# Altium project FPGA Board.PrjPcb
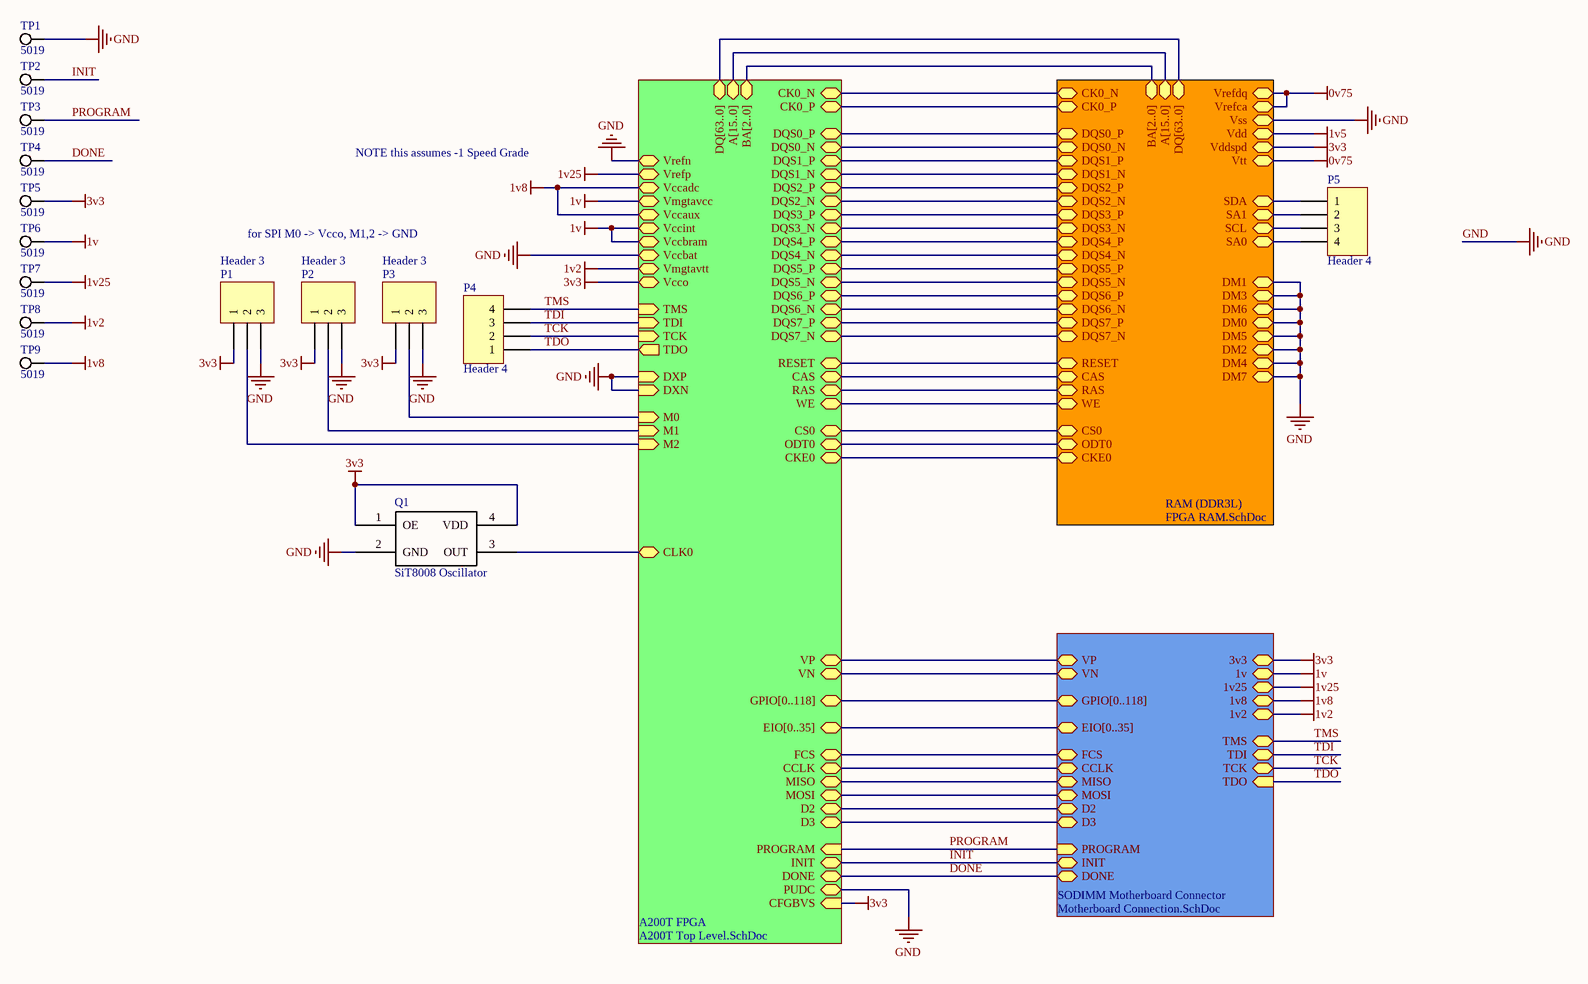
[diagram p0: FPGA Board Top.SchDoc]
3 sheets, 58 parts. Net scope: hierarchical (ports join the sheet entries above them; power ports are global).
Board file: FPGA Board V1.PcbDoc
Sheets:
  FPGA Board Top.SchDoc
    A200T FPGA = A200T Top Level.SchDoc
    RAM (DDR3L) = FPGA RAM.SchDoc

## Sheet FPGA Board Top.SchDoc
size C; SheetNumber: 1; SheetTotal: 4

### Parts
P1  Header 3  [HDR1X3]
P2  Header 3  [HDR1X3]
P3  Header 3  [HDR1X3]
P4  Header 4  [HDR1X4]
P5  Header 4  [HDR1X4]
Q1  SiT8008 Oscillator  [SiT8008 2.5x2]
TP1  5019  [KSTN-5019_V]
TP2  5019  [KSTN-5019_V]
TP3  5019  [KSTN-5019_V]
TP4  5019  [KSTN-5019_V]
TP5  5019  [KSTN-5019_V]
TP6  5019  [KSTN-5019_V]
TP7  5019  [KSTN-5019_V]
TP8  5019  [KSTN-5019_V]
TP9  5019  [KSTN-5019_V]

### Sub-sheets
A200T FPGA = A200T Top Level.SchDoc: BA[2..0] (bidir), A[15..0] (bidir), DQS1_P (bidir), DQS2_N (bidir), DQS7_N (bidir), DQS0_P (bidir), DQS6_N (bidir), DQS6_P (bidir), DQS1_N (bidir), DQS7_P (bidir), DQS4_P (bidir), DQS5_N (bidir), DQS3_P (bidir), DQS0_N (bidir), DQS2_P (bidir), DQS3_N (bidir), DQS4_N (bidir), DQS5_P (bidir), RAS (bidir), RESET (bidir), WE (bidir), CAS (bidir), CK0_P (bidir), CK0_N (bidir), ODT0 (bidir), CS0 (bidir), CKE0 (bidir), Vrefp (bidir), Vccadc (bidir), Vmgtavcc (bidir), Vccaux (bidir), Vccint (bidir), Vccbram (bidir), Vccbat (bidir), Vmgtavtt (bidir), Vcco (bidir), DQ[63..0] (bidir), Vrefn (bidir), PUDC (bidir), FCS (bidir), CCLK (bidir), INIT (bidir), MISO (bidir), DONE (bidir), MOSI (bidir), D2 (bidir), D3 (bidir), CLK0 (bidir), VP (bidir), VN (bidir), EIO[0..35] (bidir), GPIO[0..118] (bidir), TDO (out), CFGBVS (in), TMS (in), TCK (in), PROGRAM (in), TDI (in), DXP (in), M2 (in), M0 (in), DXN (in), M1 (in)
RAM (DDR3L) = FPGA RAM.SchDoc: Vrefdq (bidir), Vrefca (bidir), Vss (bidir), Vdd (bidir), DQS0_P (bidir), DQS6_N (bidir), DQS7_P (bidir), DQS1_P (bidir), DQS7_N (bidir), DQS3_P (bidir), DQS1_N (bidir), DQS4_N (bidir), DQS2_P (bidir), DQS5_P (bidir), DQS3_N (bidir), DQS4_P (bidir), DQS5_N (bidir), DQS2_N (bidir), DQS0_N (bidir), DQS6_P (bidir), SDA (bidir), SA1 (bidir), SCL (bidir), SA0 (bidir), Vddspd (bidir), Vtt (bidir), BA[2..0] (bidir), A[15..0] (bidir), CK0_N (bidir), CK0_P (bidir), RESET (bidir), CAS (bidir), RAS (bidir), WE (bidir), CS0 (bidir), ODT0 (bidir), CKE0 (bidir), DQ[63..0] (bidir), DM1 (bidir), DM3 (bidir), DM6 (bidir), DM0 (bidir), DM5 (bidir), DM2 (bidir), DM4 (bidir), DM7 (bidir)
SODIMM Motherboard Connector = Motherboard Connection.SchDoc (file not in this document): 3v3 (bidir), 1v (bidir), 1v25 (bidir), 1v8 (bidir), 1v2 (bidir), TDO (in), TMS (bidir), TCK (bidir), TDI (bidir), MOSI (bidir), D2 (bidir), MISO (bidir), FCS (bidir), D3 (bidir), CCLK (bidir), VP (bidir), VN (bidir), GPIO[0..118] (bidir), EIO[0..35] (bidir), PROGRAM (in), INIT (bidir), DONE (bidir)

### Nets
0v75: sheet RAM (DDR3L)/Vrefdq, sheet RAM (DDR3L)/Vrefca, sheet RAM (DDR3L)/Vtt  [project net Vrefca]
1v: TP6.1 ; sheet A200T FPGA/Vmgtavcc, sheet A200T FPGA/Vccint, sheet A200T FPGA/Vccbram, sheet SODIMM Motherboard Connector/1v  [project net Vccbram]
1v2: TP8.1 ; sheet A200T FPGA/Vmgtavtt, sheet SODIMM Motherboard Connector/1v2  [project net Vmgtavtt]
1v8: TP9.1 ; sheet A200T FPGA/Vccadc, sheet A200T FPGA/Vccaux, sheet SODIMM Motherboard Connector/1v8  [project net Vccadc]
1v25: TP7.1 ; sheet A200T FPGA/Vrefp, sheet SODIMM Motherboard Connector/1v25  [project net Vrefp]
3v3: P1.1 P2.1 P3.1 Q1.1(OE) Q1.4(VDD) TP5.1 ; sheet A200T FPGA/Vcco, sheet A200T FPGA/CFGBVS, sheet RAM (DDR3L)/Vddspd, sheet SODIMM Motherboard Connector/3v3  [project net CFGBVS]
GND: P1.3 P2.3 P3.3 Q1.2(GND) TP1.1 ; sheet A200T FPGA/Vccbat, sheet A200T FPGA/Vrefn, sheet A200T FPGA/PUDC, sheet A200T FPGA/DXP, sheet A200T FPGA/DXN, sheet RAM (DDR3L)/Vss, sheet RAM (DDR3L)/DM1, sheet RAM (DDR3L)/DM3, sheet RAM (DDR3L)/DM6, sheet RAM (DDR3L)/DM0, sheet RAM (DDR3L)/DM5, sheet RAM (DDR3L)/DM2, sheet RAM (DDR3L)/DM4, sheet RAM (DDR3L)/DM7  [project net DXN]
CAS: sheet A200T FPGA/CAS, sheet RAM (DDR3L)/CAS
CCLK: sheet A200T FPGA/CCLK, sheet SODIMM Motherboard Connector/CCLK
CK0_N: sheet A200T FPGA/CK0_N, sheet RAM (DDR3L)/CK0_N
CK0_P: sheet A200T FPGA/CK0_P, sheet RAM (DDR3L)/CK0_P
CKE0: sheet A200T FPGA/CKE0, sheet RAM (DDR3L)/CKE0
CLK0: Q1.3(OUT) ; sheet A200T FPGA/CLK0
CS0: sheet A200T FPGA/CS0, sheet RAM (DDR3L)/CS0
D2: sheet A200T FPGA/D2, sheet SODIMM Motherboard Connector/D2
D3: sheet A200T FPGA/D3, sheet SODIMM Motherboard Connector/D3
DONE: TP4.1 ; sheet A200T FPGA/DONE, sheet SODIMM Motherboard Connector/DONE
DQS0_N: sheet A200T FPGA/DQS0_N, sheet RAM (DDR3L)/DQS0_N
DQS0_P: sheet A200T FPGA/DQS0_P, sheet RAM (DDR3L)/DQS0_P
DQS1_N: sheet A200T FPGA/DQS1_N, sheet RAM (DDR3L)/DQS1_N
DQS1_P: sheet A200T FPGA/DQS1_P, sheet RAM (DDR3L)/DQS1_P
DQS2_N: sheet A200T FPGA/DQS2_N, sheet RAM (DDR3L)/DQS2_N
DQS2_P: sheet A200T FPGA/DQS2_P, sheet RAM (DDR3L)/DQS2_P
DQS3_N: sheet A200T FPGA/DQS3_N, sheet RAM (DDR3L)/DQS3_N
DQS3_P: sheet A200T FPGA/DQS3_P, sheet RAM (DDR3L)/DQS3_P
DQS4_N: sheet A200T FPGA/DQS4_N, sheet RAM (DDR3L)/DQS4_N
DQS4_P: sheet A200T FPGA/DQS4_P, sheet RAM (DDR3L)/DQS4_P
DQS5_N: sheet A200T FPGA/DQS5_N, sheet RAM (DDR3L)/DQS5_N
DQS5_P: sheet A200T FPGA/DQS5_P, sheet RAM (DDR3L)/DQS5_P
DQS6_N: sheet A200T FPGA/DQS6_N, sheet RAM (DDR3L)/DQS6_N
DQS6_P: sheet A200T FPGA/DQS6_P, sheet RAM (DDR3L)/DQS6_P
DQS7_N: sheet A200T FPGA/DQS7_N, sheet RAM (DDR3L)/DQS7_N
DQS7_P: sheet A200T FPGA/DQS7_P, sheet RAM (DDR3L)/DQS7_P
FCS: sheet A200T FPGA/FCS, sheet SODIMM Motherboard Connector/FCS
INIT: TP2.1 ; sheet A200T FPGA/INIT, sheet SODIMM Motherboard Connector/INIT
M0: P3.2 ; sheet A200T FPGA/M0
M1: P2.2 ; sheet A200T FPGA/M1
M2: P1.2 ; sheet A200T FPGA/M2
MISO: sheet A200T FPGA/MISO, sheet SODIMM Motherboard Connector/MISO
MOSI: sheet A200T FPGA/MOSI, sheet SODIMM Motherboard Connector/MOSI
ODT0: sheet A200T FPGA/ODT0, sheet RAM (DDR3L)/ODT0
PROGRAM: TP3.1 ; sheet A200T FPGA/PROGRAM, sheet SODIMM Motherboard Connector/PROGRAM
RAS: sheet A200T FPGA/RAS, sheet RAM (DDR3L)/RAS
RESET: sheet A200T FPGA/RESET, sheet RAM (DDR3L)/RESET
SA0: P5.4 ; sheet RAM (DDR3L)/SA0
SA1: P5.2 ; sheet RAM (DDR3L)/SA1
SCL: P5.3 ; sheet RAM (DDR3L)/SCL
SDA: P5.1 ; sheet RAM (DDR3L)/SDA
TCK: P4.2 ; sheet A200T FPGA/TCK, sheet SODIMM Motherboard Connector/TCK
TDI: P4.3 ; sheet A200T FPGA/TDI, sheet SODIMM Motherboard Connector/TDI
TDO: P4.1 ; sheet A200T FPGA/TDO, sheet SODIMM Motherboard Connector/TDO
TMS: P4.4 ; sheet A200T FPGA/TMS, sheet SODIMM Motherboard Connector/TMS
VN: sheet A200T FPGA/VN, sheet SODIMM Motherboard Connector/VN
VP: sheet A200T FPGA/VP, sheet SODIMM Motherboard Connector/VP
WE: sheet A200T FPGA/WE, sheet RAM (DDR3L)/WE

### Buses and harness runs
bus sheet A200T FPGA/A[15..0] = sheet RAM (DDR3L)/A[15..0]
bus sheet A200T FPGA/BA[2..0] = sheet RAM (DDR3L)/BA[2..0]
bus sheet A200T FPGA/DQ[63..0] = sheet RAM (DDR3L)/DQ[63..0]
bus sheet A200T FPGA/EIO[0..35] = sheet SODIMM Motherboard Connector/EIO[0..35]
bus sheet A200T FPGA/GPIO[0..118] = sheet SODIMM Motherboard Connector/GPIO[0..118]

### Notes on the sheet
- NOTE this assumes -1 Speed Grade
- for SPI M0 -> Vcco, M1,2 -> GND

### Library data of the parts
P1-P3 = Header 3: Header, 3-Pin; LatestRevisionDate: 17-Jul-2002; LatestRevisionNote: Re-released for DXP Platform.; Publisher: Altium Limited
P4 P5 = Header 4: Header, 4-Pin; LatestRevisionDate: 17-Jul-2002; LatestRevisionNote: Re-released for DXP Platform.; Publisher: Altium Limited
TP1-TP9 = CMP-1672-00008-1: Test Point, 1 Position SMD, RoHS, Tape and Reel; ComponentLink1Description: Manufacturer URL; Package Quantity: 1000; DatasheetVersion: 03/2014; Packaging: Tape and Reel; ComponentLink2URL: http://www.keyelco.com/product-pdf.cfm?p=1357; ComponentLink1URL: http://www.keyelco.com/; Mount: Surface Mount; Contact Plating: Silver; PackageDescription: 1-Pin Surface Mount Device, Body 3.81 x 2.03 mm; Pins: 1; RoHSCompliant: True; Mounting Technology: Surface Mount; ComponentLink2Description: Datasheet; PackageReference: 5019

## Sheet A200T Top Level.SchDoc
size A1; SheetNumber: 2; SheetTotal: 4
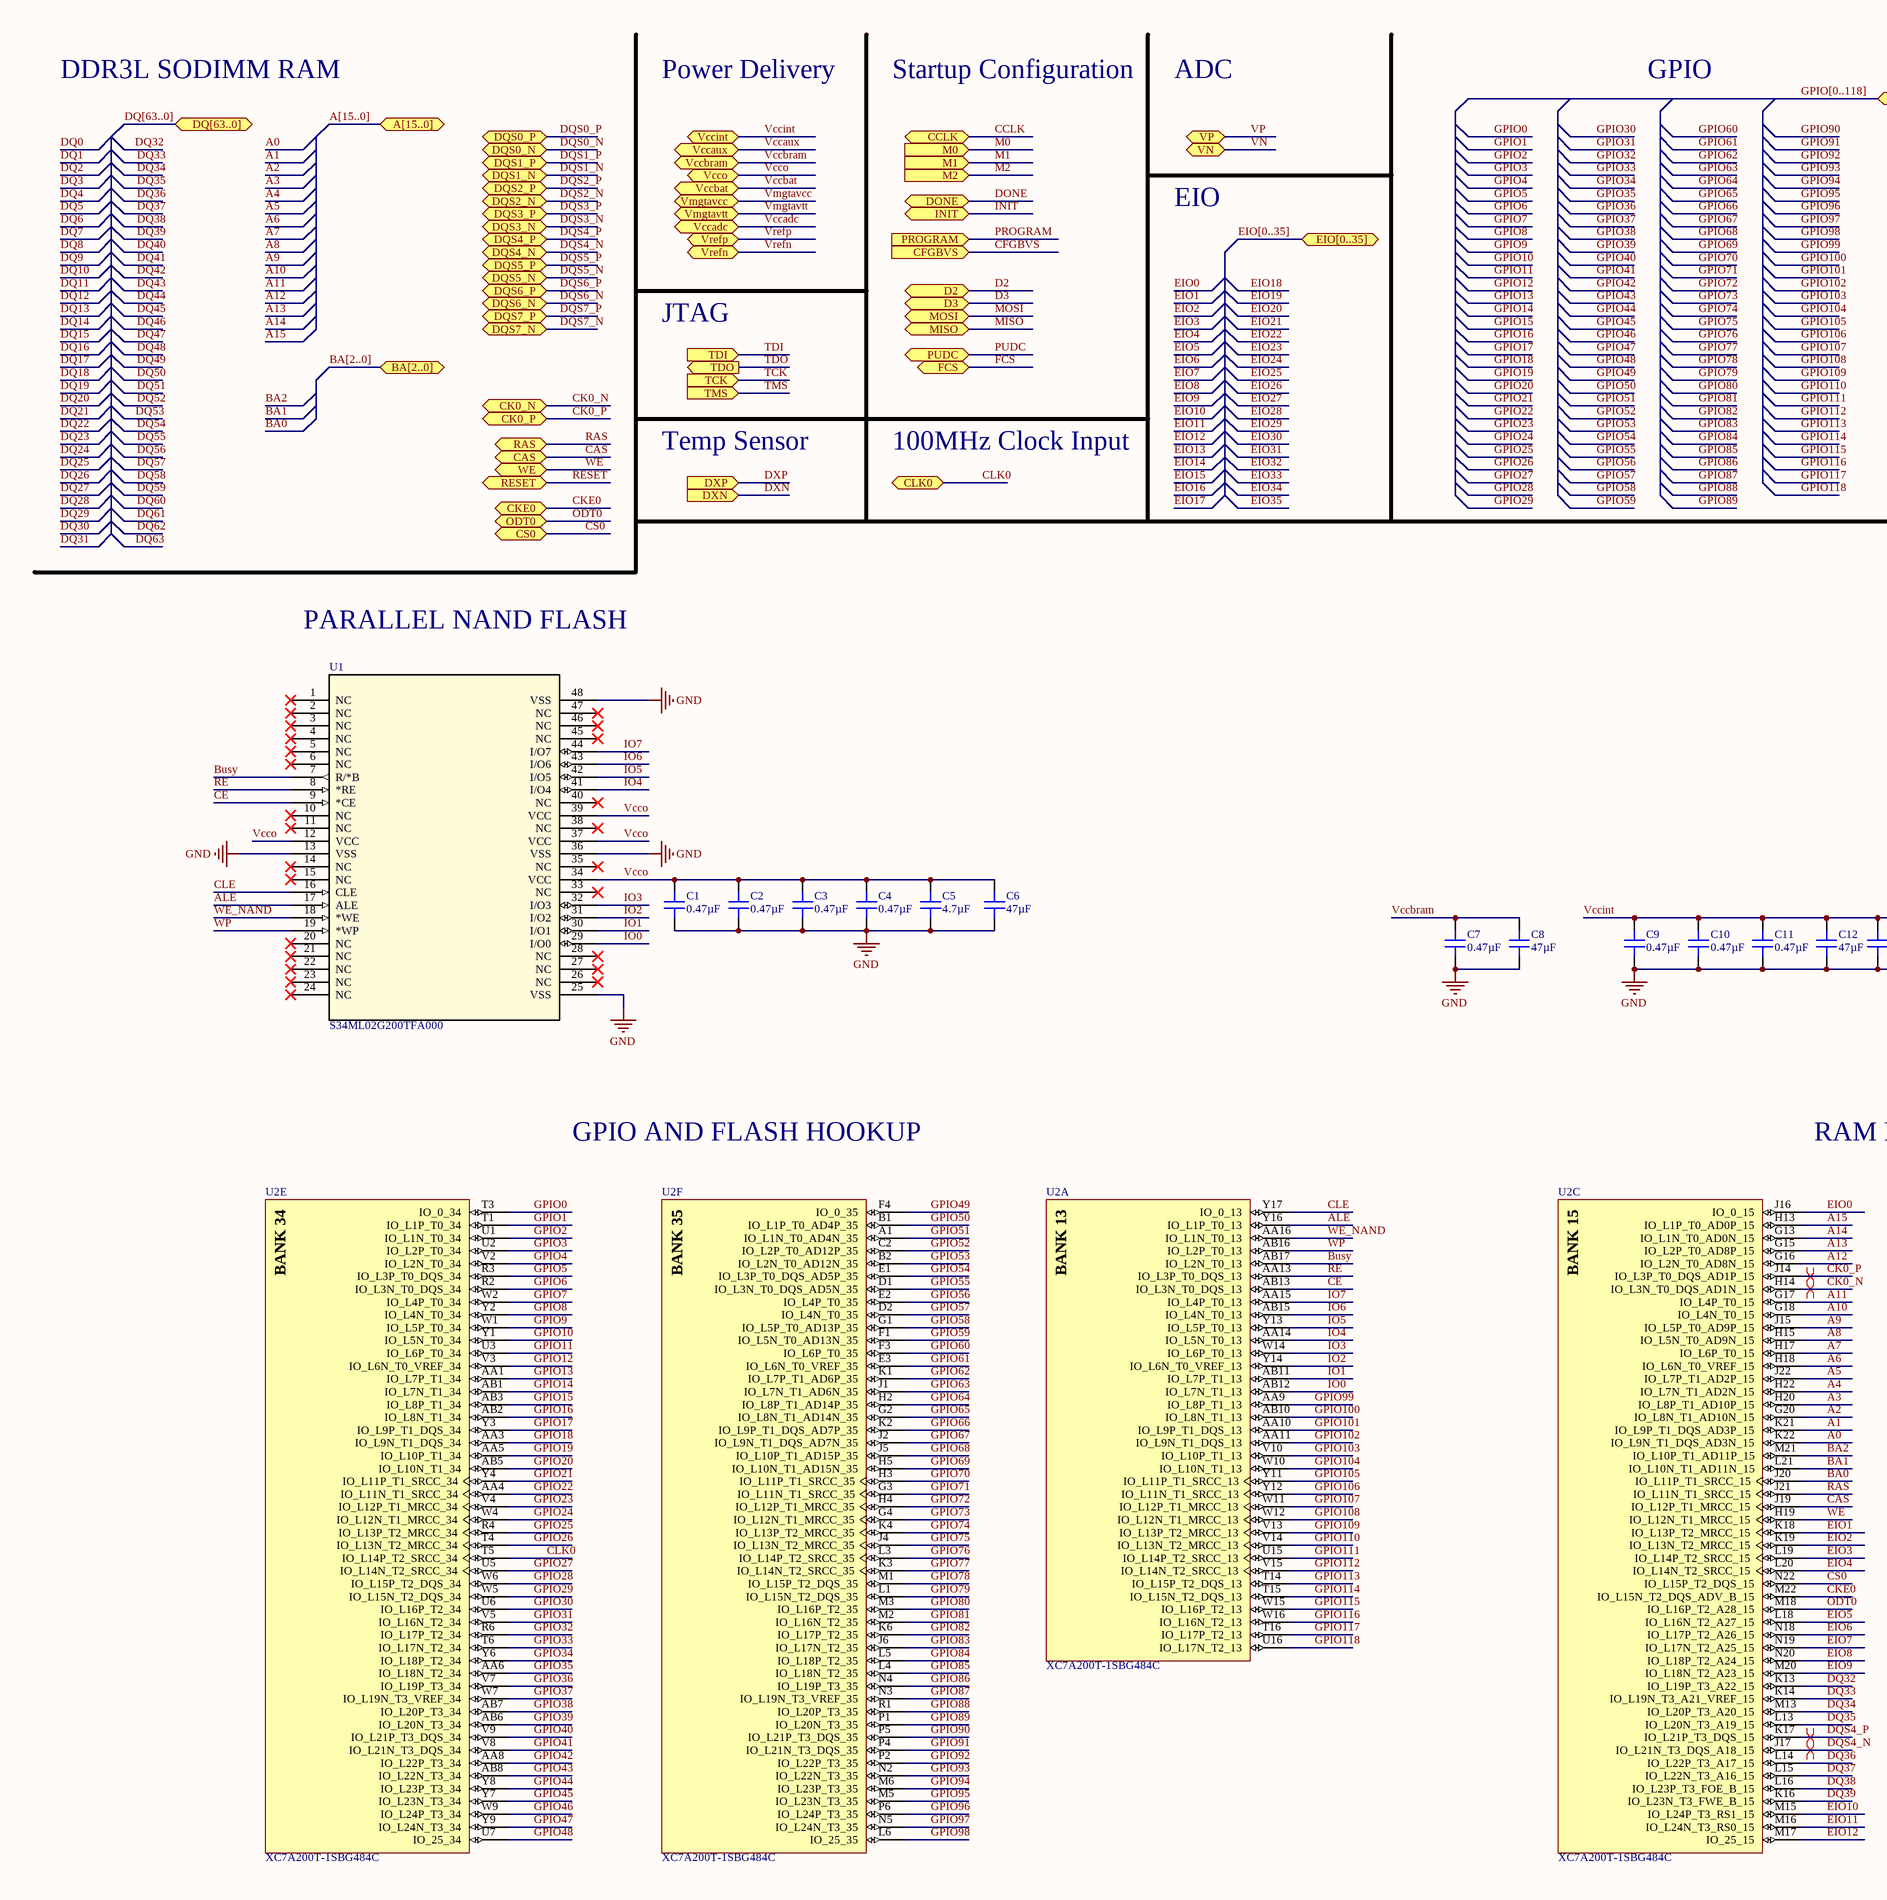
[diagram p1: A200T Top Level.SchDoc, left]
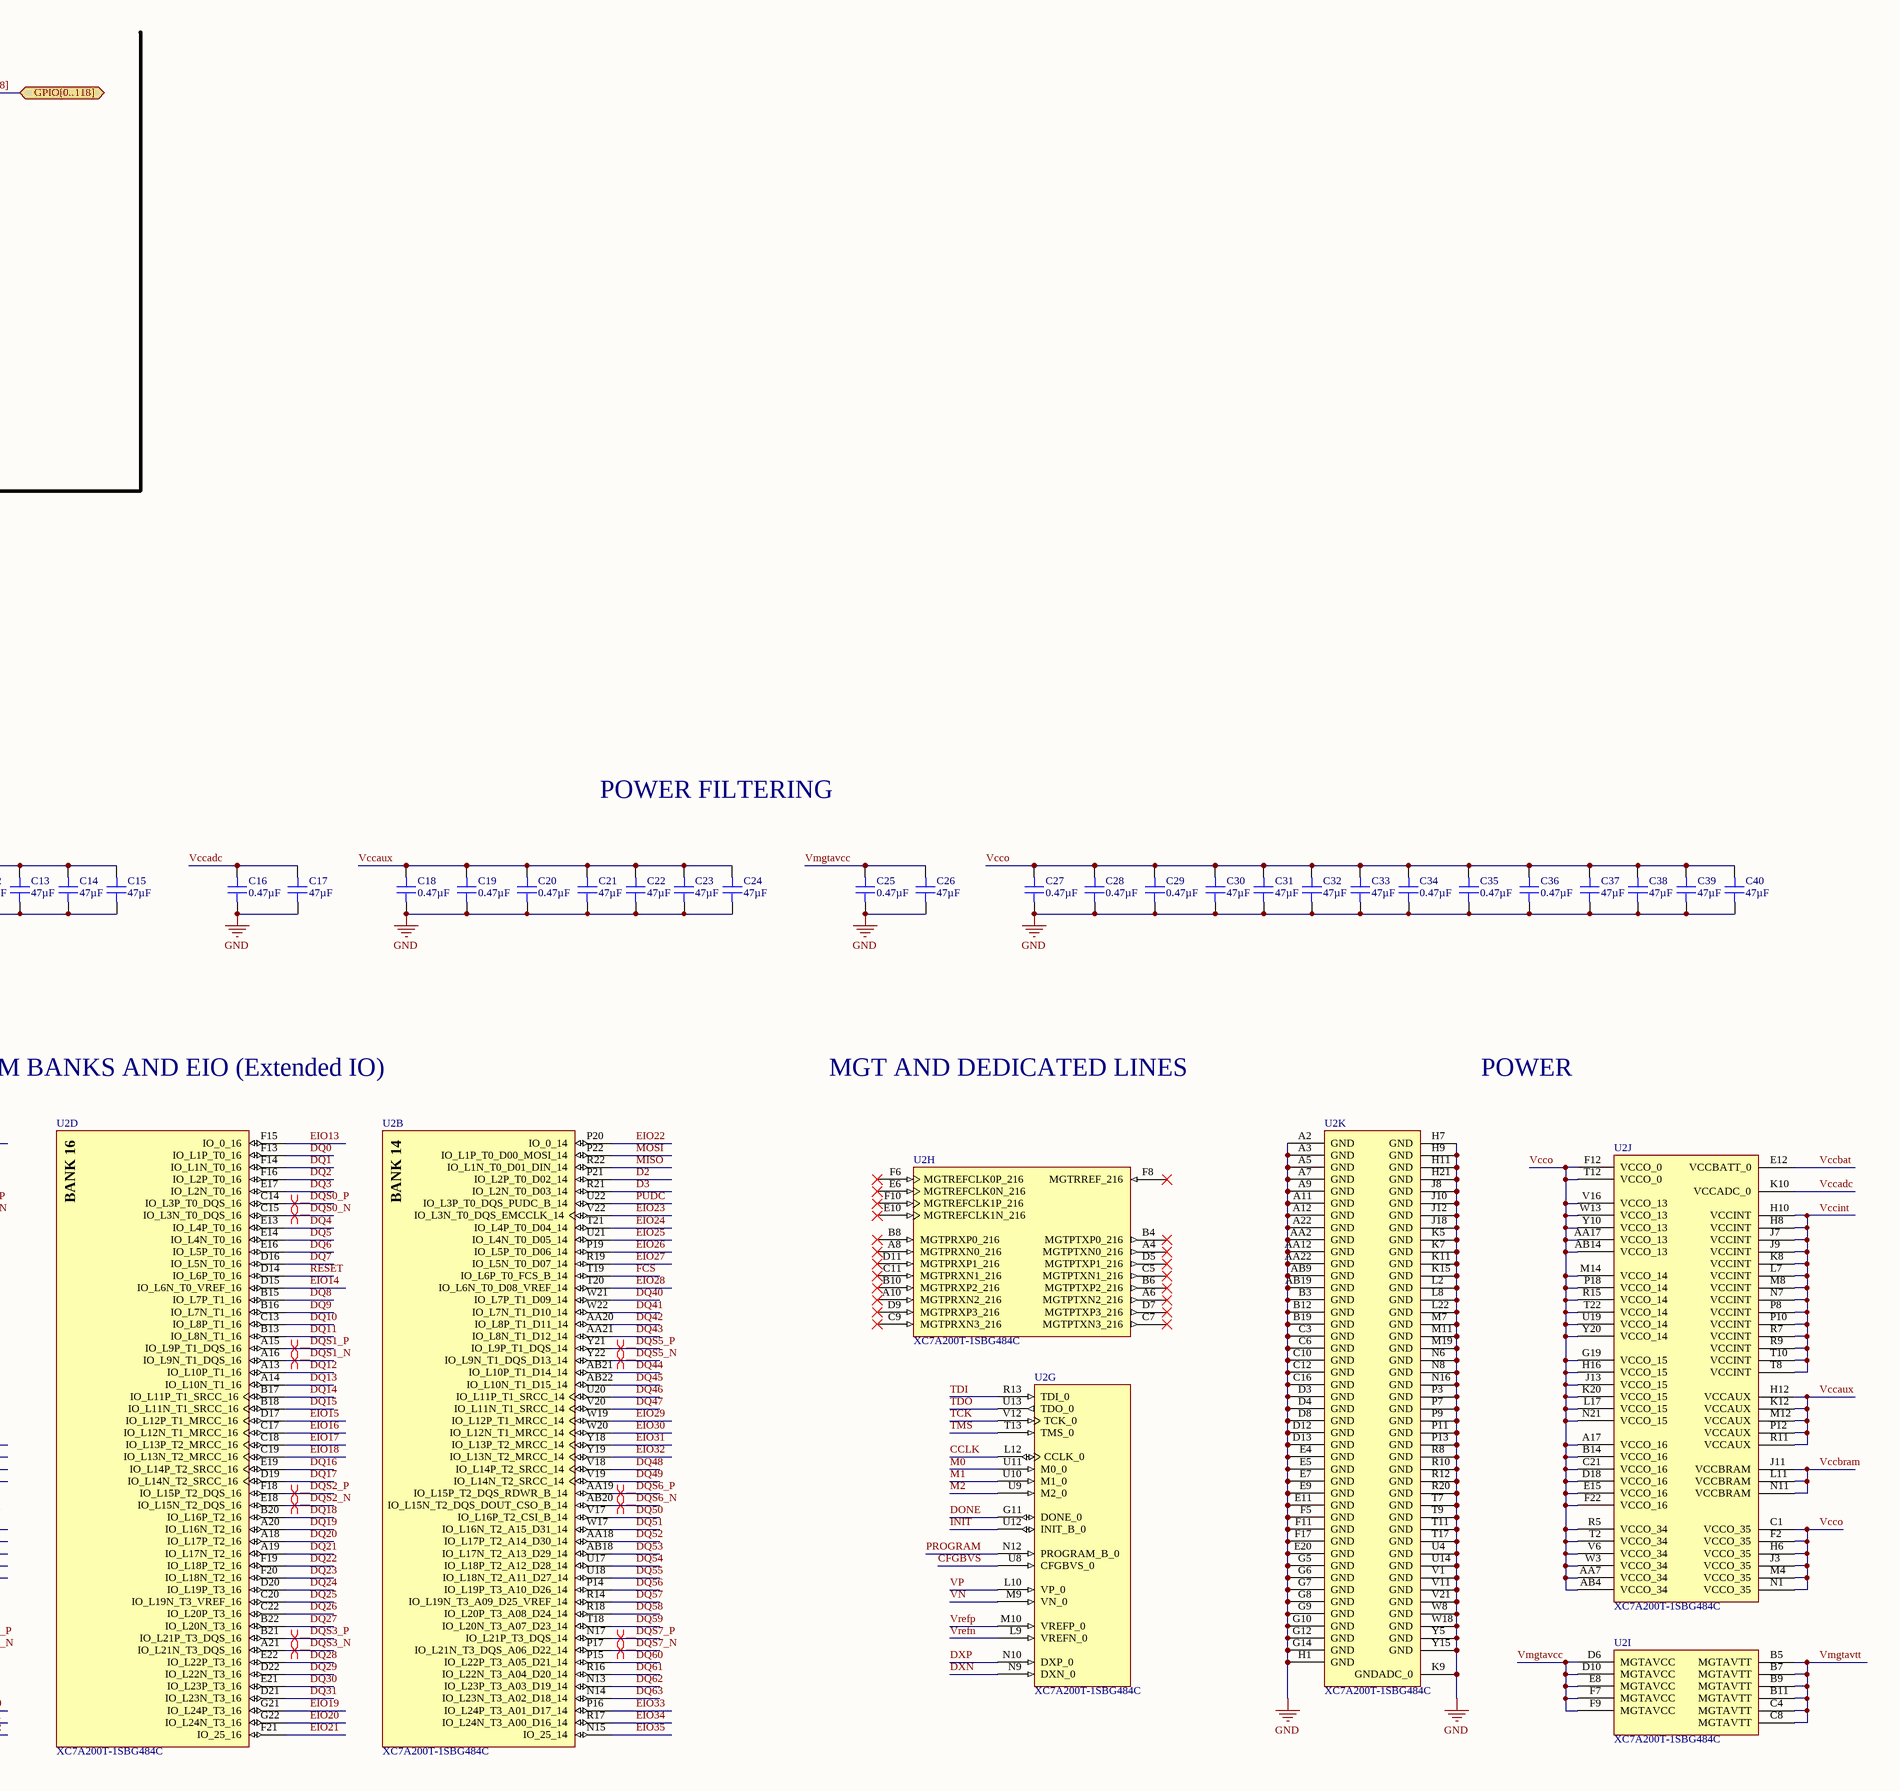
[diagram p2: A200T Top Level.SchDoc, right]

### Parts
C1  0.47µF  [CAP 0603_1608]
C2  0.47µF  [CAP 0603_1608]
C3  0.47µF  [CAP 0603_1608]
C4  0.47µF  [CAP 0603_1608]
C5  4.7µF  [CAP 0603_1608]
C6  47µF  [CAP 0805_2012]
C7  0.47µF  [CAP 0603_1608]
C8  47µF  [CAP 0805_2012]
C9  0.47µF  [CAP 0603_1608]
C10  0.47µF  [CAP 0603_1608]
C11  0.47µF  [CAP 0603_1608]
C12  47µF  [CAP 0805_2012]
C13  47µF  [CAP 0805_2012]
C14  47µF  [CAP 0805_2012]
C15  47µF  [CAP 0805_2012]
C16  0.47µF  [CAP 0603_1608]
C17  47µF  [CAP 0805_2012]
C18  0.47µF  [CAP 0603_1608]
C19  0.47µF  [CAP 0603_1608]
C20  0.47µF  [CAP 0603_1608]
C21  47µF  [CAP 0805_2012]
C22  47µF  [CAP 0805_2012]
C23  47µF  [CAP 0805_2012]
C24  47µF  [CAP 0805_2012]
C25  0.47µF  [CAP 0603_1608]
C26  47µF  [CAP 0805_2012]
C27  0.47µF  [CAP 0603_1608]
C28  0.47µF  [CAP 0603_1608]
C29  0.47µF  [CAP 0603_1608]
C30  47µF  [CAP 0805_2012]
C31  47µF  [CAP 0805_2012]
C32  47µF  [CAP 0805_2012]
C33  47µF  [CAP 0805_2012]
C34  0.47µF  [CAP 0603_1608]
C35  0.47µF  [CAP 0603_1608]
C36  0.47µF  [CAP 0603_1608]
C37  47µF  [CAP 0805_2012]
C38  47µF  [CAP 0805_2012]
C39  47µF  [CAP 0805_2012]
C40  47µF  [CAP 0805_2012]
U1  S34ML02G200TFA000  [TSOP-48_TSOP1_SPA]
U2  XC7A200T-1SBG484C  [SBG484]  (parts A,B,C,D,E,F,G,H,I,J,K of 11)

### Ports
A[15..0] (bidir), BA[2..0] (bidir), CAS (bidir), CCLK (bidir), CFGBVS (in), CK0_N (bidir), CK0_P (bidir), CKE0 (bidir), CLK0 (bidir), CS0 (bidir), D2 (bidir), D3 (bidir), DONE (bidir), DQ[63..0] (bidir), DQS0_N (bidir), DQS0_P (bidir), DQS1_N (bidir), DQS1_P (bidir), DQS2_N (bidir), DQS2_P (bidir), DQS3_N (bidir), DQS3_P (bidir), DQS4_N (bidir), DQS4_P (bidir), DQS5_N (bidir), DQS5_P (bidir), DQS6_N (bidir), DQS6_P (bidir), DQS7_N (bidir), DQS7_P (bidir), DXN (in), DXP (in), EIO[0..35] (bidir), FCS (bidir), GPIO[0..118] (bidir), INIT (bidir), M0 (in), M1 (in), M2 (in), MISO (bidir), MOSI (bidir), ODT0 (bidir), PROGRAM (in), PUDC (bidir), RAS (bidir), RESET (bidir), TCK (in), TDI (in), TDO (out), TMS (in), Vccadc (bidir), Vccaux (bidir), Vccbat (bidir), Vccbram (bidir), Vccint (bidir), Vcco (bidir), Vmgtavcc (bidir), Vmgtavtt (bidir), VN (bidir), VP (bidir), Vrefn (bidir), Vrefp (bidir), WE (bidir)

### Nets
CFGBVS: C1.2 C2.2 C3.2 C4.2 C5.2 C6.2 C27.2 C28.2 C29.2 C30.2 C31.2 C32.2 C33.2 C34.2 C35.2 C36.2 C37.2 C38.2 C39.2 C40.2 U1.12(VCC) U1.34(VCC) U1.37(VCC) U1.39(VCC) U2.A17(VCCO_16) U2.AA7(VCCO_34) U2.AA17(VCCO_13) U2.AB4(VCCO_34) U2.AB14(VCCO_13) U2.B14(VCCO_16) U2.C1(VCCO_35) U2.C21(VCCO_16) U2.D18(VCCO_16) U2.E15(VCCO_16) U2.F2(VCCO_35) U2.F12(VCCO_0) U2.F22(VCCO_16) U2.G19(VCCO_15) U2.H6(VCCO_35) U2.H16(VCCO_15) U2.J3(VCCO_35) U2.J13(VCCO_15) U2.K20(VCCO_15) U2.L17(VCCO_15) U2.M4(VCCO_35) U2.M14(VCCO_14) U2.N1(VCCO_35) U2.N21(VCCO_15) U2.P18(VCCO_14) U2.R5(VCCO_34) U2.R15(VCCO_14) U2.T2(VCCO_34) U2.T12(VCCO_0) U2.T22(VCCO_14) U2.U8(CFGBVS_0) U2.U19(VCCO_14) U2.V6(VCCO_34) U2.V16(VCCO_13) U2.W3(VCCO_34) U2.W13(VCCO_13) U2.Y10(VCCO_13) U2.Y20(VCCO_14) ; port Vcco, port CFGBVS  [also labelled Vcco]
DXN: C1.1 C2.1 C3.1 C4.1 C5.1 C6.1 C7.1 C8.1 C9.1 C10.1 C11.1 C12.1 C13.1 C14.1 C15.1 C16.1 C17.1 C18.1 C19.1 C20.1 C21.1 C22.1 C23.1 C24.1 C25.1 C26.1 C27.1 C28.1 C29.1 C30.1 C31.1 C32.1 C33.1 C34.1 C35.1 C36.1 C37.1 C38.1 C39.1 C40.1 U1.13(VSS) U1.25(VSS) U1.36(VSS) U1.48(VSS) U2.A2(GND) U2.A3(GND) U2.A5(GND) U2.A7(GND) U2.A9(GND) U2.A11(GND) U2.A12(GND) U2.A22(GND) U2.AA2(GND) U2.AA12(GND) U2.AA22(GND) U2.AB9(GND) U2.AB19(GND) U2.B3(GND) U2.B12(GND) U2.B19(GND) U2.C3(GND) U2.C6(GND) U2.C10(GND) U2.C12(GND) U2.C16(GND) U2.D3(GND) U2.D4(GND) U2.D8(GND) U2.D12(GND) U2.D13(GND) U2.E4(GND) U2.E5(GND) U2.E7(GND) U2.E9(GND) U2.E11(GND) U2.E12(VCCBATT_0) U2.E20(GND) U2.F5(GND) U2.F11(GND) U2.F17(GND) U2.G5(GND) U2.G6(GND) U2.G7(GND) U2.G8(GND) U2.G9(GND) U2.G10(GND) U2.G12(GND) U2.G14(GND) U2.H1(GND) U2.H7(GND) U2.H9(GND) U2.H11(GND) U2.H21(GND) U2.J8(GND) U2.J10(GND) U2.J12(GND) U2.J18(GND) U2.K5(GND) U2.K7(GND) U2.K9(GNDADC_0) U2.K11(GND) U2.K15(GND) U2.L2(GND) U2.L8(GND) U2.L9(VREFN_0) U2.L22(GND) U2.M7(GND) U2.M11(GND) U2.M19(GND) U2.N6(GND) U2.N8(GND) U2.N9(DXN_0) U2.N10(DXP_0) U2.N16(GND) U2.P3(GND) U2.P7(GND) U2.P9(GND) U2.P11(GND) U2.P13(GND) U2.R8(GND) U2.R10(GND) U2.R12(GND) U2.R20(GND) U2.T7(GND) U2.T9(GND) U2.T11(GND) U2.T17(GND) U2.U4(GND) U2.U14(GND) U2.U22(IO_L3P_T0_DQS_PUDC_B_14) U2.V1(GND) U2.V11(GND) U2.V21(GND) U2.W8(GND) U2.W18(GND) U2.Y5(GND) U2.Y15(GND) ; port Vccbat, port Vrefn, port PUDC, port DXP, port DXN  [also labelled DXP, GND, PUDC, Vccbat, Vrefn]
Vccadc: C16.2 C17.2 C18.2 C19.2 C20.2 C21.2 C22.2 C23.2 C24.2 U2.H12(VCCAUX) U2.K10(VCCADC_0) U2.K12(VCCAUX) U2.M12(VCCAUX) U2.P12(VCCAUX) U2.R11(VCCAUX) ; port Vccaux, port Vccadc  [also labelled Vccaux]
Vccbram: C7.2 C8.2 C9.2 C10.2 C11.2 C12.2 C13.2 C14.2 C15.2 C25.2 C26.2 U2.D6(MGTAVCC) U2.D10(MGTAVCC) U2.E8(MGTAVCC) U2.F7(MGTAVCC) U2.F9(MGTAVCC) U2.H8(VCCINT) U2.H10(VCCINT) U2.J7(VCCINT) U2.J9(VCCINT) U2.J11(VCCBRAM) U2.K8(VCCINT) U2.L7(VCCINT) U2.L11(VCCBRAM) U2.M8(VCCINT) U2.N7(VCCINT) U2.N11(VCCBRAM) U2.P8(VCCINT) U2.P10(VCCINT) U2.R7(VCCINT) U2.R9(VCCINT) U2.T8(VCCINT) U2.T10(VCCINT) ; port Vccint, port Vccbram, port Vmgtavcc  [also labelled Vccint, Vmgtavcc]
Vmgtavtt: U2.B5(MGTAVTT) U2.B7(MGTAVTT) U2.B9(MGTAVTT) U2.B11(MGTAVTT) U2.C4(MGTAVTT) U2.C8(MGTAVTT) ; port Vmgtavtt
Vrefp: U2.M10(VREFP_0) ; port Vrefp
A0: U2.K22(IO_L9N_T1_DQS_AD3N_15)
A1: U2.K21(IO_L9P_T1_DQS_AD3P_15)
A2: U2.G20(IO_L8N_T1_AD10N_15)
A3: U2.H20(IO_L8P_T1_AD10P_15)
A4: U2.H22(IO_L7N_T1_AD2N_15)
A5: U2.J22(IO_L7P_T1_AD2P_15)
A6: U2.H18(IO_L6N_T0_VREF_15)
A7: U2.H17(IO_L6P_T0_15)
A8: U2.H15(IO_L5N_T0_AD9N_15)
A9: U2.J15(IO_L5P_T0_AD9P_15)
A10: U2.G18(IO_L4N_T0_15)
A11: U2.G17(IO_L4P_T0_15)
A12: U2.G16(IO_L2N_T0_AD8N_15)
A13: U2.G15(IO_L2P_T0_AD8P_15)
A14: U2.G13(IO_L1N_T0_AD0N_15)
A15: U2.H13(IO_L1P_T0_AD0P_15)
ALE: U1.17(ALE) U2.Y16(IO_L1P_T0_13)
BA0: U2.J20(IO_L11P_T1_SRCC_15)
BA1: U2.L21(IO_L10N_T1_AD11N_15)
BA2: U2.M21(IO_L10P_T1_AD11P_15)
Busy: U1.7(R/*B) U2.AB17(IO_L2N_T0_13)
CAS: U2.J19(IO_L12P_T1_MRCC_15) ; port CAS
CCLK: U2.L12(CCLK_0) ; port CCLK
CE: U1.9(*CE) U2.AB13(IO_L3N_T0_DQS_13)
CK0_N: U2.H14(IO_L3N_T0_DQS_AD1N_15) ; port CK0_N
CK0_P: U2.J14(IO_L3P_T0_DQS_AD1P_15) ; port CK0_P
CKE0: U2.M22(IO_L15N_T2_DQS_ADV_B_15) ; port CKE0
CLE: U1.16(CLE) U2.Y17(IO_0_13)
CLK0: U2.T5(IO_L14P_T2_SRCC_34) ; port CLK0
CS0: U2.N22(IO_L15P_T2_DQS_15) ; port CS0
D2: U2.P21(IO_L2P_T0_D02_14) ; port D2
D3: U2.R21(IO_L2N_T0_D03_14) ; port D3
DONE: U2.G11(DONE_0) ; port DONE
DQ0: U2.F13(IO_L1P_T0_16)
DQ1: U2.F14(IO_L1N_T0_16)
DQ2: U2.F16(IO_L2P_T0_16)
DQ3: U2.E17(IO_L2N_T0_16)
DQ4: U2.E13(IO_L4P_T0_16)
DQ5: U2.E14(IO_L4N_T0_16)
DQ6: U2.E16(IO_L5P_T0_16)
DQ7: U2.D16(IO_L5N_T0_16)
DQ8: U2.B15(IO_L7P_T1_16)
DQ9: U2.B16(IO_L7N_T1_16)
DQ10: U2.C13(IO_L8P_T1_16)
DQ11: U2.B13(IO_L8N_T1_16)
DQ12: U2.A13(IO_L10P_T1_16)
DQ13: U2.A14(IO_L10N_T1_16)
DQ14: U2.B17(IO_L11P_T1_SRCC_16)
DQ15: U2.B18(IO_L11N_T1_SRCC_16)
DQ16: U2.E19(IO_L14P_T2_SRCC_16)
DQ17: U2.D19(IO_L14N_T2_SRCC_16)
DQ18: U2.B20(IO_L16P_T2_16)
DQ19: U2.A20(IO_L16N_T2_16)
DQ20: U2.A18(IO_L17P_T2_16)
DQ21: U2.A19(IO_L17N_T2_16)
DQ22: U2.F19(IO_L18P_T2_16)
DQ23: U2.F20(IO_L18N_T2_16)
DQ24: U2.D20(IO_L19P_T3_16)
DQ25: U2.C20(IO_L19N_T3_VREF_16)
DQ26: U2.C22(IO_L20P_T3_16)
DQ27: U2.B22(IO_L20N_T3_16)
DQ28: U2.E22(IO_L22P_T3_16)
DQ29: U2.D22(IO_L22N_T3_16)
DQ30: U2.E21(IO_L23P_T3_16)
DQ31: U2.D21(IO_L23N_T3_16)
DQ32: U2.K13(IO_L19P_T3_A22_15)
DQ33: U2.K14(IO_L19N_T3_A21_VREF_15)
DQ34: U2.M13(IO_L20P_T3_A20_15)
DQ35: U2.L13(IO_L20N_T3_A19_15)
DQ36: U2.L14(IO_L22P_T3_A17_15)
DQ37: U2.L15(IO_L22N_T3_A16_15)
DQ38: U2.L16(IO_L23P_T3_FOE_B_15)
DQ39: U2.K16(IO_L23N_T3_FWE_B_15)
DQ40: U2.W21(IO_L7P_T1_D09_14)
DQ41: U2.W22(IO_L7N_T1_D10_14)
DQ42: U2.AA20(IO_L8P_T1_D11_14)
DQ43: U2.AA21(IO_L8N_T1_D12_14)
DQ44: U2.AB21(IO_L10P_T1_D14_14)
DQ45: U2.AB22(IO_L10N_T1_D15_14)
DQ46: U2.U20(IO_L11P_T1_SRCC_14)
DQ47: U2.V20(IO_L11N_T1_SRCC_14)
DQ48: U2.V18(IO_L14P_T2_SRCC_14)
DQ49: U2.V19(IO_L14N_T2_SRCC_14)
DQ50: U2.V17(IO_L16P_T2_CSI_B_14)
DQ51: U2.W17(IO_L16N_T2_A15_D31_14)
DQ52: U2.AA18(IO_L17P_T2_A14_D30_14)
DQ53: U2.AB18(IO_L17N_T2_A13_D29_14)
DQ54: U2.U17(IO_L18P_T2_A12_D28_14)
DQ55: U2.U18(IO_L18N_T2_A11_D27_14)
DQ56: U2.P14(IO_L19P_T3_A10_D26_14)
DQ57: U2.R14(IO_L19N_T3_A09_D25_VREF_14)
DQ58: U2.R18(IO_L20P_T3_A08_D24_14)
DQ59: U2.T18(IO_L20N_T3_A07_D23_14)
DQ60: U2.P15(IO_L22P_T3_A05_D21_14)
DQ61: U2.R16(IO_L22N_T3_A04_D20_14)
DQ62: U2.N13(IO_L23P_T3_A03_D19_14)
DQ63: U2.N14(IO_L23N_T3_A02_D18_14)
DQS0_N: U2.C15(IO_L3N_T0_DQS_16) ; port DQS0_N
DQS0_P: U2.C14(IO_L3P_T0_DQS_16) ; port DQS0_P
DQS1_N: U2.A16(IO_L9N_T1_DQS_16) ; port DQS1_N
DQS1_P: U2.A15(IO_L9P_T1_DQS_16) ; port DQS1_P
DQS2_N: U2.E18(IO_L15N_T2_DQS_16) ; port DQS2_N
DQS2_P: U2.F18(IO_L15P_T2_DQS_16) ; port DQS2_P
DQS3_N: U2.A21(IO_L21N_T3_DQS_16) ; port DQS3_N
DQS3_P: U2.B21(IO_L21P_T3_DQS_16) ; port DQS3_P
DQS4_N: U2.J17(IO_L21N_T3_DQS_A18_15) ; port DQS4_N
DQS4_P: U2.K17(IO_L21P_T3_DQS_15) ; port DQS4_P
DQS5_N: U2.Y22(IO_L9N_T1_DQS_D13_14) ; port DQS5_N
DQS5_P: U2.Y21(IO_L9P_T1_DQS_14) ; port DQS5_P
DQS6_N: U2.AB20(IO_L15N_T2_DQS_DOUT_CSO_B_14) ; port DQS6_N
DQS6_P: U2.AA19(IO_L15P_T2_DQS_RDWR_B_14) ; port DQS6_P
DQS7_N: U2.P17(IO_L21N_T3_DQS_A06_D22_14) ; port DQS7_N
DQS7_P: U2.N17(IO_L21P_T3_DQS_14) ; port DQS7_P
EIO0: U2.J16(IO_0_15)
EIO1: U2.K18(IO_L13P_T2_MRCC_15)
EIO2: U2.K19(IO_L13N_T2_MRCC_15)
EIO3: U2.L19(IO_L14P_T2_SRCC_15)
EIO4: U2.L20(IO_L14N_T2_SRCC_15)
EIO5: U2.L18(IO_L16N_T2_A27_15)
EIO6: U2.N18(IO_L17P_T2_A26_15)
EIO7: U2.N19(IO_L17N_T2_A25_15)
EIO8: U2.N20(IO_L18P_T2_A24_15)
EIO9: U2.M20(IO_L18N_T2_A23_15)
EIO10: U2.M15(IO_L24P_T3_RS1_15)
EIO11: U2.M16(IO_L24N_T3_RS0_15)
EIO12: U2.M17(IO_25_15)
EIO13: U2.F15(IO_0_16)
EIO14: U2.D15(IO_L6N_T0_VREF_16)
EIO15: U2.D17(IO_L12P_T1_MRCC_16)
EIO16: U2.C17(IO_L12N_T1_MRCC_16)
EIO17: U2.C18(IO_L13P_T2_MRCC_16)
EIO18: U2.C19(IO_L13N_T2_MRCC_16)
EIO19: U2.G21(IO_L24P_T3_16)
EIO20: U2.G22(IO_L24N_T3_16)
EIO21: U2.F21(IO_25_16)
EIO22: U2.P20(IO_0_14)
EIO23: U2.V22(IO_L3N_T0_DQS_EMCCLK_14)
EIO24: U2.T21(IO_L4P_T0_D04_14)
EIO25: U2.U21(IO_L4N_T0_D05_14)
EIO26: U2.P19(IO_L5P_T0_D06_14)
EIO27: U2.R19(IO_L5N_T0_D07_14)
EIO28: U2.T20(IO_L6N_T0_D08_VREF_14)
EIO29: U2.W19(IO_L12P_T1_MRCC_14)
EIO30: U2.W20(IO_L12N_T1_MRCC_14)
EIO31: U2.Y18(IO_L13P_T2_MRCC_14)
EIO32: U2.Y19(IO_L13N_T2_MRCC_14)
EIO33: U2.P16(IO_L24P_T3_A01_D17_14)
EIO34: U2.R17(IO_L24N_T3_A00_D16_14)
EIO35: U2.N15(IO_25_14)
FCS: U2.T19(IO_L6P_T0_FCS_B_14) ; port FCS
GPIO0: U2.T3(IO_0_34)
GPIO1: U2.T1(IO_L1P_T0_34)
GPIO2: U2.U1(IO_L1N_T0_34)
GPIO3: U2.U2(IO_L2P_T0_34)
GPIO4: U2.V2(IO_L2N_T0_34)
GPIO5: U2.R3(IO_L3P_T0_DQS_34)
GPIO6: U2.R2(IO_L3N_T0_DQS_34)
GPIO7: U2.W2(IO_L4P_T0_34)
GPIO8: U2.Y2(IO_L4N_T0_34)
GPIO9: U2.W1(IO_L5P_T0_34)
GPIO10: U2.Y1(IO_L5N_T0_34)
GPIO11: U2.U3(IO_L6P_T0_34)
GPIO12: U2.V3(IO_L6N_T0_VREF_34)
GPIO13: U2.AA1(IO_L7P_T1_34)
GPIO14: U2.AB1(IO_L7N_T1_34)
GPIO15: U2.AB3(IO_L8P_T1_34)
GPIO16: U2.AB2(IO_L8N_T1_34)
GPIO17: U2.Y3(IO_L9P_T1_DQS_34)
GPIO18: U2.AA3(IO_L9N_T1_DQS_34)
GPIO19: U2.AA5(IO_L10P_T1_34)
GPIO20: U2.AB5(IO_L10N_T1_34)
GPIO21: U2.Y4(IO_L11P_T1_SRCC_34)
GPIO22: U2.AA4(IO_L11N_T1_SRCC_34)
GPIO23: U2.V4(IO_L12P_T1_MRCC_34)
GPIO24: U2.W4(IO_L12N_T1_MRCC_34)
GPIO25: U2.R4(IO_L13P_T2_MRCC_34)
GPIO26: U2.T4(IO_L13N_T2_MRCC_34)
GPIO27: U2.U5(IO_L14N_T2_SRCC_34)
GPIO28: U2.W6(IO_L15P_T2_DQS_34)
GPIO29: U2.W5(IO_L15N_T2_DQS_34)
GPIO30: U2.U6(IO_L16P_T2_34)
GPIO31: U2.V5(IO_L16N_T2_34)
GPIO32: U2.R6(IO_L17P_T2_34)
GPIO33: U2.T6(IO_L17N_T2_34)
GPIO34: U2.Y6(IO_L18P_T2_34)
GPIO35: U2.AA6(IO_L18N_T2_34)
GPIO36: U2.V7(IO_L19P_T3_34)
GPIO37: U2.W7(IO_L19N_T3_VREF_34)
GPIO38: U2.AB7(IO_L20P_T3_34)
GPIO39: U2.AB6(IO_L20N_T3_34)
GPIO40: U2.V9(IO_L21P_T3_DQS_34)
GPIO41: U2.V8(IO_L21N_T3_DQS_34)
GPIO42: U2.AA8(IO_L22P_T3_34)
GPIO43: U2.AB8(IO_L22N_T3_34)
GPIO44: U2.Y8(IO_L23P_T3_34)
GPIO45: U2.Y7(IO_L23N_T3_34)
GPIO46: U2.W9(IO_L24P_T3_34)
GPIO47: U2.Y9(IO_L24N_T3_34)
GPIO48: U2.U7(IO_25_34)
GPIO49: U2.F4(IO_0_35)
GPIO50: U2.B1(IO_L1P_T0_AD4P_35)
GPIO51: U2.A1(IO_L1N_T0_AD4N_35)
GPIO52: U2.C2(IO_L2P_T0_AD12P_35)
GPIO53: U2.B2(IO_L2N_T0_AD12N_35)
GPIO54: U2.E1(IO_L3P_T0_DQS_AD5P_35)
GPIO55: U2.D1(IO_L3N_T0_DQS_AD5N_35)
GPIO56: U2.E2(IO_L4P_T0_35)
GPIO57: U2.D2(IO_L4N_T0_35)
GPIO58: U2.G1(IO_L5P_T0_AD13P_35)
GPIO59: U2.F1(IO_L5N_T0_AD13N_35)
GPIO60: U2.F3(IO_L6P_T0_35)
GPIO61: U2.E3(IO_L6N_T0_VREF_35)
GPIO62: U2.K1(IO_L7P_T1_AD6P_35)
GPIO63: U2.J1(IO_L7N_T1_AD6N_35)
GPIO64: U2.H2(IO_L8P_T1_AD14P_35)
GPIO65: U2.G2(IO_L8N_T1_AD14N_35)
GPIO66: U2.K2(IO_L9P_T1_DQS_AD7P_35)
GPIO67: U2.J2(IO_L9N_T1_DQS_AD7N_35)
GPIO68: U2.J5(IO_L10P_T1_AD15P_35)
GPIO69: U2.H5(IO_L10N_T1_AD15N_35)
GPIO70: U2.H3(IO_L11P_T1_SRCC_35)
GPIO71: U2.G3(IO_L11N_T1_SRCC_35)
GPIO72: U2.H4(IO_L12P_T1_MRCC_35)
GPIO73: U2.G4(IO_L12N_T1_MRCC_35)
GPIO74: U2.K4(IO_L13P_T2_MRCC_35)
GPIO75: U2.J4(IO_L13N_T2_MRCC_35)
GPIO76: U2.L3(IO_L14P_T2_SRCC_35)
GPIO77: U2.K3(IO_L14N_T2_SRCC_35)
GPIO78: U2.M1(IO_L15P_T2_DQS_35)
GPIO79: U2.L1(IO_L15N_T2_DQS_35)
GPIO80: U2.M3(IO_L16P_T2_35)
GPIO81: U2.M2(IO_L16N_T2_35)
GPIO82: U2.K6(IO_L17P_T2_35)
GPIO83: U2.J6(IO_L17N_T2_35)
GPIO84: U2.L5(IO_L18P_T2_35)
GPIO85: U2.L4(IO_L18N_T2_35)
GPIO86: U2.N4(IO_L19P_T3_35)
GPIO87: U2.N3(IO_L19N_T3_VREF_35)
GPIO88: U2.R1(IO_L20P_T3_35)
GPIO89: U2.P1(IO_L20N_T3_35)
GPIO90: U2.P5(IO_L21P_T3_DQS_35)
GPIO91: U2.P4(IO_L21N_T3_DQS_35)
GPIO92: U2.P2(IO_L22P_T3_35)
GPIO93: U2.N2(IO_L22N_T3_35)
GPIO94: U2.M6(IO_L23P_T3_35)
GPIO95: U2.M5(IO_L23N_T3_35)
GPIO96: U2.P6(IO_L24P_T3_35)
GPIO97: U2.N5(IO_L24N_T3_35)
GPIO98: U2.L6(IO_25_35)
GPIO99: U2.AA9(IO_L8P_T1_13)
GPIO100: U2.AB10(IO_L8N_T1_13)
GPIO101: U2.AA10(IO_L9P_T1_DQS_13)
GPIO102: U2.AA11(IO_L9N_T1_DQS_13)
GPIO103: U2.V10(IO_L10P_T1_13)
GPIO104: U2.W10(IO_L10N_T1_13)
GPIO105: U2.Y11(IO_L11P_T1_SRCC_13)
GPIO106: U2.Y12(IO_L11N_T1_SRCC_13)
GPIO107: U2.W11(IO_L12P_T1_MRCC_13)
GPIO108: U2.W12(IO_L12N_T1_MRCC_13)
GPIO109: U2.V13(IO_L13P_T2_MRCC_13)
GPIO110: U2.V14(IO_L13N_T2_MRCC_13)
GPIO111: U2.U15(IO_L14P_T2_SRCC_13)
GPIO112: U2.V15(IO_L14N_T2_SRCC_13)
GPIO113: U2.T14(IO_L15P_T2_DQS_13)
GPIO114: U2.T15(IO_L15N_T2_DQS_13)
GPIO115: U2.W15(IO_L16P_T2_13)
GPIO116: U2.W16(IO_L16N_T2_13)
GPIO117: U2.T16(IO_L17P_T2_13)
GPIO118: U2.U16(IO_L17N_T2_13)
INIT: U2.U12(INIT_B_0) ; port INIT
IO0: U1.29(I/O0) U2.AB12(IO_L7N_T1_13)
IO1: U1.30(I/O1) U2.AB11(IO_L7P_T1_13)
IO2: U1.31(I/O2) U2.Y14(IO_L6N_T0_VREF_13)
IO3: U1.32(I/O3) U2.W14(IO_L6P_T0_13)
IO4: U1.41(I/O4) U2.AA14(IO_L5N_T0_13)
IO5: U1.42(I/O5) U2.Y13(IO_L5P_T0_13)
IO6: U1.43(I/O6) U2.AB15(IO_L4N_T0_13)
IO7: U1.44(I/O7) U2.AA15(IO_L4P_T0_13)
M0: U2.U11(M0_0) ; port M0
M1: U2.U10(M1_0) ; port M1
M2: U2.U9(M2_0) ; port M2
MISO: U2.R22(IO_L1N_T0_D01_DIN_14) ; port MISO
MOSI: U2.P22(IO_L1P_T0_D00_MOSI_14) ; port MOSI
ODT0: U2.M18(IO_L16P_T2_A28_15) ; port ODT0
PROGRAM: U2.N12(PROGRAM_B_0) ; port PROGRAM
RAS: U2.J21(IO_L11N_T1_SRCC_15) ; port RAS
RE: U1.8(*RE) U2.AA13(IO_L3P_T0_DQS_13)
RESET: U2.D14(IO_L6P_T0_16) ; port RESET
TCK: U2.V12(TCK_0) ; port TCK
TDI: U2.R13(TDI_0) ; port TDI
TDO: U2.U13(TDO_0) ; port TDO
TMS: U2.T13(TMS_0) ; port TMS
VN: U2.M9(VN_0) ; port VN
VP: U2.L10(VP_0) ; port VP
WE: U2.H19(IO_L12N_T1_MRCC_15) ; port WE
WE_NAND: U1.18(*WE) U2.AA16(IO_L1N_T0_13)
WP: U1.19(*WP) U2.AB16(IO_L2P_T0_13)

Not connected (* = marked no-connect by the designer): U1 1(NC)* 2(NC)* 3(NC)* 4(NC)* 5(NC)* 6(NC)* 10(NC)* 11(NC)* 14(NC)* 15(NC)* 20(NC)* 21(NC)* 22(NC)* 23(NC)* 24(NC)* 26(NC)* 27(NC)* 28(NC)* 33(NC)* 35(NC)* 38(NC)* 40(NC)* 45(NC)* 46(NC)* 47(NC)*; U2 A4(MGTPTXN0_216)* A6(MGTPTXN2_216)* A8(MGTPRXN0_216)* A10(MGTPRXN2_216)* B4(MGTPTXP0_216)* B6(MGTPTXP2_216)* B8(MGTPRXP0_216)* B10(MGTPRXP2_216)* C5(MGTPTXN1_216)* C7(MGTPTXN3_216)* C9(MGTPRXN3_216)* C11(MGTPRXN1_216)* D5(MGTPTXP1_216)* D7(MGTPTXP3_216)* D9(MGTPRXP3_216)* D11(MGTPRXP1_216)* E6(MGTREFCLK0N_216)* E10(MGTREFCLK1N_216)* F6(MGTREFCLK0P_216)* F8(MGTRREF_216)* F10(MGTREFCLK1P_216)*

### Buses and harness runs
bus A[15..0] = port A[15..0]
bus BA[2..0] = port BA[2..0]
bus DQ[63..0] = port DQ[63..0]
bus EIO[0..35] = port EIO[0..35]
bus GPIO[0..118] = port GPIO[0..118]

### Layout directives
differential pair: CK0_N, CK0_P, DQS0_N, DQS0_P, DQS1_N, DQS1_P, DQS2_N, DQS2_P, DQS3_N, DQS3_P, DQS4_N, DQS4_P, DQS5_N, DQS5_P, DQS6_N, DQS6_P, DQS7_N, DQS7_P

### Notes on the sheet
- DDR3L SODIMM RAM
- Power Delivery
- Startup Configuration
- ADC
- GPIO
- EIO
- JTAG
- Temp Sensor
- 100MHz Clock Input
- PARALLEL NAND FLASH
- POWER FILTERING
- GPIO AND FLASH HOOKUP
- RAM BANKS AND EIO (Extended IO)
- MGT AND DEDICATED LINES
- POWER
- (in symbol XC7A200T-1SBG484C, part A) BANK 13
- (in symbol XC7A200T-1SBG484C, part B) BANK 14
- (in symbol XC7A200T-1SBG484C, part C) BANK 15
- (in symbol XC7A200T-1SBG484C, part D) BANK 16
- (in symbol XC7A200T-1SBG484C, part E) BANK 34
- (in symbol XC7A200T-1SBG484C, part F) BANK 35

### Library data of the parts
C1-C4 C7 C9-C11 C16 C18-C20 C25 C27-C29 C34-C36 = 885012106015: CAP CER 0.47UF 16V X5R 0603; Manufacturer: Würth Elektronik; Tolerance: ±20%; Part Number: 885012106015; Value: 0.47µF; Applications: General Purpose; Capacitance: 0.47µF; ComponentLink1Description: Datasheet; ComponentLink1URL: https://katalog.we-online.de/pbs/datasheet/885012106015.pdf; ComponentLink2Description: DigiKey Link; ComponentLink2URL: http://digikey.com/product-detail/en/w-rth-elektronik/885012106015/732-7912-1-ND/5454539; Device Package: 0603 (1608 Metric); LastUpdated: 2020-09-02 1:03:18 AM; Lifecycle Status: Active; Minimum Order: 1; Mounting Type: Surface Mount, MLCC; Operating Temperature: -55°C ~ 85°C; Package / Case: 0603 (1608 Metric); Packaging: TapeAndReel; PartId: 11963; Part Status: Active; Price: 0.04; Series: WCAP-CSGP; Size / Dimension: 0.063" L x 0.031" W (1.60mm x 0.80mm); Supplier 1: DigiKey; Supplier Part Number 1: 732-7912-1-ND; Temperature Coefficient: X5R; Thickness (Max): 0.037" (0.95mm); Voltage - Rated: 16V
C5 = CL10A475KQ8NNNC: CAP CER 4.7UF 6.3V X5R 0603; Manufacturer: Samsung Electro-Mechanics; Tolerance: ±10%; Part Number: CL10A475KQ8NNNC; Value: 4.7µF; Applications: General Purpose; Capacitance: 4.7µF; ComponentLink1Description: Datasheet; ComponentLink1URL: http://www.samsungsem.com/kr/support/product-search/mlcc/CL10A475KQ8NNNC.jsp; ComponentLink2Description: DigiKey Link; ComponentLink2URL: http://digikey.com/product-detail/en/samsung-electro-mechanics/CL10A475KQ8NNNC/1276-1045-1-ND/3889131; Device Package: 0603 (1608 Metric); LastUpdated: 2020-09-02 1:03:30 AM; Lifecycle Status: Active; Minimum Order: 1; Mounting Type: Surface Mount, MLCC; Operating Temperature: -55°C ~ 85°C; Package / Case: 0603 (1608 Metric); Packaging: TapeAndReel; PartId: 5557; Part Status: Active; Price: 0.01; Series: CL; Size / Dimension: 0.063" L x 0.031" W (1.60mm x 0.80mm); Supplier 1: DigiKey; Supplier Part Number 1: 1276-1045-1-ND; Temperature Coefficient: X5R; Thickness (Max): 0.035" (0.90mm); Voltage - Rated: 6.3V
C6 C8 C12-C15 C17 C21-C24 C26 C30-C33 C37-C40 = GRM21BR61A476ME15L: CAP CER 47UF 10V X5R 0805; Manufacturer: Murata Electronics; Tolerance: ±20%; Part Number: GRM21BR61A476ME15L; Value: 47µF; Applications: General Purpose; Capacitance: 47µF; ComponentLink1Description: Datasheet; ComponentLink1URL: https://search.murata.co.jp/Ceramy/image/img/A01X/G101/ENG/GRM21BR61A476ME15-01.pdf; ComponentLink2Description: DigiKey Link; ComponentLink2URL: http://digikey.com/product-detail/en/murata-electronics/GRM21BR61A476ME15L/490-9961-1-ND/5026442; Device Package: 0805 (2012 Metric); LastUpdated: 2020-09-02 1:04:38 AM; Lifecycle Status: Active; Minimum Order: 1; Mounting Type: Surface Mount, MLCC; Operating Temperature: -55°C ~ 85°C; Package / Case: 0805 (2012 Metric); Packaging: TapeAndReel; PartId: 4627; Part Status: Active; Price: 0.19; Series: GRM; Size / Dimension: 0.079" L x 0.049" W (2.00mm x 1.25mm); Supplier 1: DigiKey; Supplier Part Number 1: 490-9961-1-ND; Temperature Coefficient: X5R; Thickness (Max): 0.057" (1.45mm); Voltage - Rated: 10V
U1 = S34ML02G200TFA000: No Description Available; Mfr_Name: Cypress Semiconductor; Copyright: Copyright (C) 2021 Ultra Librarian. All rights reserved.; Manufacturer_Part_Number: S34ML02G200TFA000; Digi-Key_Part_Number_1: 428-4274-ND; Digi-Key_Part_Number_2: 2120-S34MS01G200TFI000-ND; Digi-Key_Part_Number_3: 2832-S34MS01G200TFI000-ND; RefDes: RefDes; Type: DEV
U2 = XC7A200T-1SBG484C: Artix-7 FPGA, 285 User I/Os, 4 GTP, 484-Ball BGA, Speed Grade 1, Commercial Grade, Pb-Free; Manufacturer: Xilinx; Block RAM Blocks (18Kb): 730; Block RAM Blocks (36Kb): 365; Block RAM Blocks (Max Kb): 13140; CLBs (Slices): 33650; Clock Mgmt Tiles (CMTs): 10; DSP48E1 Slices: 740; Logic Cells: 215360; Max User I/O: 500; Speed Grade: -1; DatasheetVersion: v1.12; PackageVersion: Rev 1.8; PackageReference: SBG484; PackageDescription: Flip-Chip Lidless BGA, Body 19 x 19 mm, 0.8 mm Pitch; Supplier 1: Digi-Key; Supplier Part Number 1: 122-1867-ND; CLBs (Max Distributed RAM Kb): 2888; Generic Part Number: XC7A200T; RoHS: Pb-Free; NexusDeviceID: XC7A200T-1SBG484C; Mounting Technology: Surface Mount; Code_JEDEC: MO-275-PPA2; PartNumber: XC7A200T-1SBG484C; ComponentLink1Description: Manufacturer URL; ComponentLink1URL: http://www.xilinx.com/; ComponentLink2Description: Datasheet; ComponentLink2URL: http://www.xilinx.com/support/documentation/data_sheets/ds180_7Series_Overview.pdf; ComponentLink3Description: Package Specification; ComponentLink3URL: http://www.xilinx.com/support/documentation/user_guides/ug475_7Series_Pkg_Pinout.pdf; ComponentLink4Description: DC and Switching Characteristics; ComponentLink4URL: http://www.xilinx.com/support/documentation/data_sheets/ds181_Artix_7_Data_Sheet.pdf; ComponentLink5Description: Package File; ComponentLink5URL: http://www.xilinx.com/support/packagefiles/a7packages/xc7a200tsbg484pkg.txt; ComponentLink6Description: Packaging and Pinout; ComponentLink6URL: http://www.xilinx.com/support/documentation/user_guides/ug475_7Series_Pkg_Pinout.pdf

## Sheet FPGA RAM.SchDoc
size A; SheetNumber: 3; SheetTotal: 3
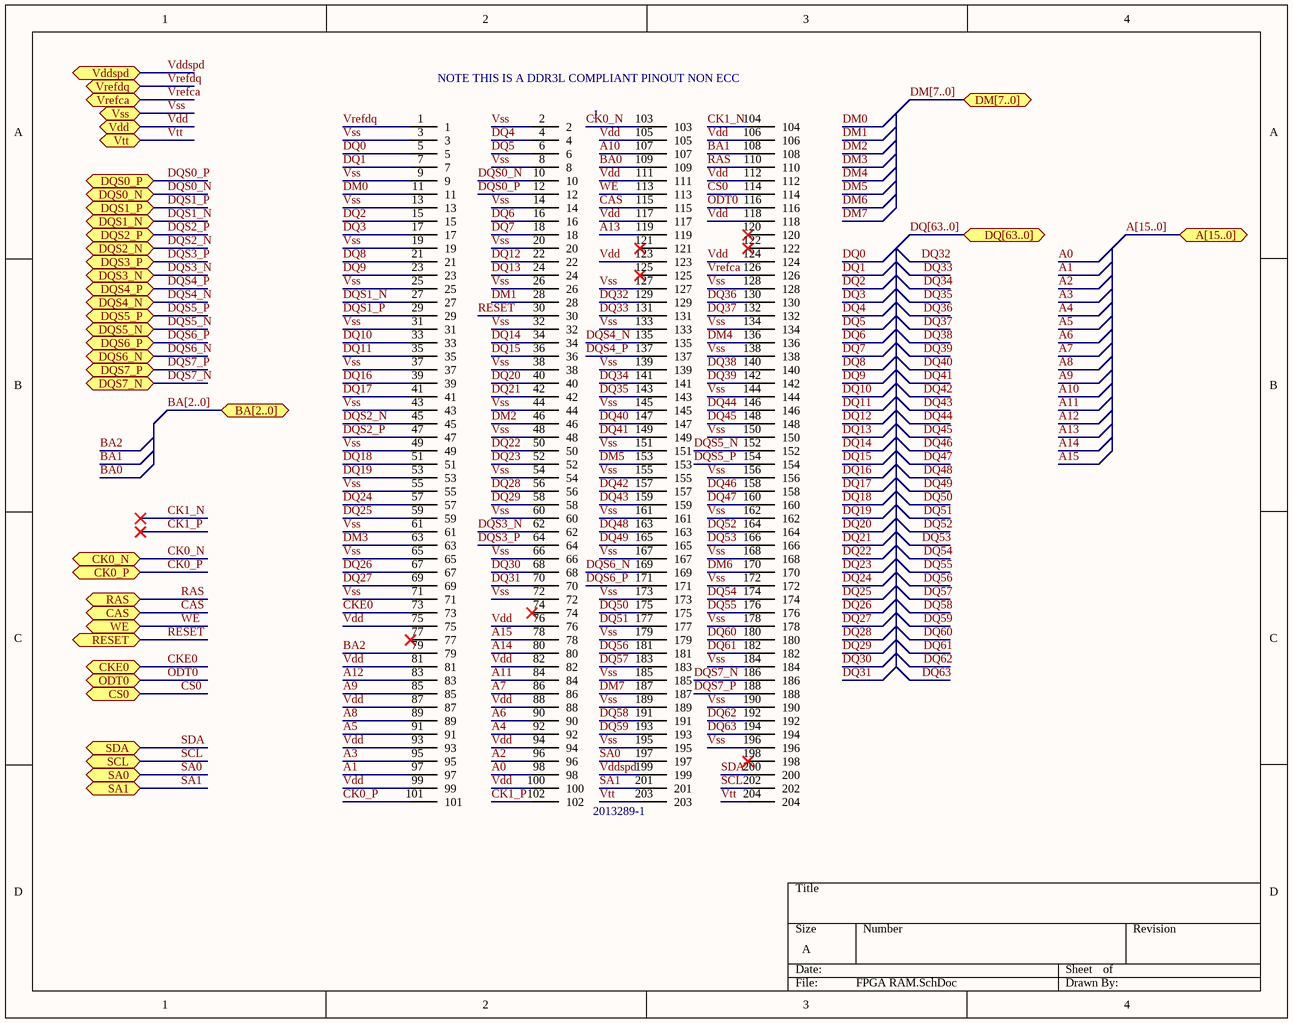
[diagram p3: FPGA RAM.SchDoc]

### Parts
J  2013289-1  [TE_2013289-1]

### Ports
A[15..0] (bidir), BA[2..0] (bidir), CAS (bidir), CK0_N (bidir), CK0_P (bidir), CKE0 (bidir), CS0 (bidir), DM[7..0] (bidir), DQ[63..0] (bidir), DQS0_N (bidir), DQS0_P (bidir), DQS1_N (bidir), DQS1_P (bidir), DQS2_N (bidir), DQS2_P (bidir), DQS3_N (bidir), DQS3_P (bidir), DQS4_N (bidir), DQS4_P (bidir), DQS5_N (bidir), DQS5_P (bidir), DQS6_N (bidir), DQS6_P (bidir), DQS7_N (bidir), DQS7_P (bidir), ODT0 (bidir), RAS (bidir), RESET (bidir), SA0 (bidir), SA1 (bidir), SCL (bidir), SDA (bidir), Vdd (bidir), Vddspd (bidir), Vrefca (bidir), Vrefdq (bidir), Vss (bidir), Vtt (bidir), WE (bidir)

### Nets
Vdd: J.75 J.76 J.81 J.82 J.87 J.88 J.93 J.94 J.99 J.100 J.105 J.106 J.111 J.112 J.117 J.118 J.123 J.124 ; port Vdd
Vddspd: J.199 ; port Vddspd  [project net CFGBVS]
Vrefca: J.1 J.126 J.203 J.204 ; port Vrefdq, port Vrefca, port Vtt  [also labelled Vrefdq, Vtt]
Vss: J.2 J.3 J.8 J.9 J.13 J.14 J.19 J.20 J.25 J.26 J.31 J.32 J.37 J.38 J.43 J.44 J.48 J.49 J.54 J.55 J.60 J.61 J.65 J.66 J.71 J.72 J.127 J.128 J.133 J.134 J.138 J.139 J.144 J.145 J.150 J.151 J.155 J.156 J.161 J.162 J.167 J.168 J.172 J.173 J.178 J.179 J.184 J.185 J.189 J.190 J.195 J.196 ; port Vss  [project net DXN]
A0: J.98
A1: J.97
A2: J.96
A3: J.95
A4: J.92
A5: J.91
A6: J.90
A7: J.86
A8: J.89
A9: J.85
A10: J.107
A11: J.84
A12: J.83
A13: J.119
A14: J.80
A15: J.78
BA0: J.109
BA1: J.108
BA2: J.79
CAS: J.115 ; port CAS
CK0_N: J.103 ; port CK0_N
CK0_P: J.101 ; port CK0_P
CK1_N: J.104
CK1_P: J.102
CKE0: J.73 ; port CKE0
CS0: J.114 ; port CS0
DM0: J.11
DM1: J.28
DM2: J.46
DM3: J.63
DM4: J.136
DM5: J.153
DM6: J.170
DM7: J.187
DQ0: J.5
DQ1: J.7
DQ2: J.15
DQ3: J.17
DQ4: J.4
DQ5: J.6
DQ6: J.16
DQ7: J.18
DQ8: J.21
DQ9: J.23
DQ10: J.33
DQ11: J.35
DQ12: J.22
DQ13: J.24
DQ14: J.34
DQ15: J.36
DQ16: J.39
DQ17: J.41
DQ18: J.51
DQ19: J.53
DQ20: J.40
DQ21: J.42
DQ22: J.50
DQ23: J.52
DQ24: J.57
DQ25: J.59
DQ26: J.67
DQ27: J.69
DQ28: J.56
DQ29: J.58
DQ30: J.68
DQ31: J.70
DQ32: J.129
DQ33: J.131
DQ34: J.141
DQ35: J.143
DQ36: J.130
DQ37: J.132
DQ38: J.140
DQ39: J.142
DQ40: J.147
DQ41: J.149
DQ42: J.157
DQ43: J.159
DQ44: J.146
DQ45: J.148
DQ46: J.158
DQ47: J.160
DQ48: J.163
DQ49: J.165
DQ50: J.175
DQ51: J.177
DQ52: J.164
DQ53: J.166
DQ54: J.174
DQ55: J.176
DQ56: J.181
DQ57: J.183
DQ58: J.191
DQ59: J.193
DQ60: J.180
DQ61: J.182
DQ62: J.192
DQ63: J.194
DQS0_N: J.10 ; port DQS0_N
DQS0_P: J.12 ; port DQS0_P
DQS1_N: J.27 ; port DQS1_N
DQS1_P: J.29 ; port DQS1_P
DQS2_N: J.45 ; port DQS2_N
DQS2_P: J.47 ; port DQS2_P
DQS3_N: J.62 ; port DQS3_N
DQS3_P: J.64 ; port DQS3_P
DQS4_N: J.135 ; port DQS4_N
DQS4_P: J.137 ; port DQS4_P
DQS5_N: J.152 ; port DQS5_N
DQS5_P: J.154 ; port DQS5_P
DQS6_N: J.169 ; port DQS6_N
DQS6_P: J.171 ; port DQS6_P
DQS7_N: J.186 ; port DQS7_N
DQS7_P: J.188 ; port DQS7_P
ODT0: J.116 ; port ODT0
RAS: J.110 ; port RAS
RESET: J.30 ; port RESET
SA0: J.197 ; port SA0
SA1: J.201 ; port SA1
SCL: J.202 ; port SCL
SDA: J.200 ; port SDA
WE: J.113 ; port WE

Not connected (* = marked no-connect by the designer): J 74* 77* 120* 121* 122* 125* 198*

### Buses and harness runs
bus A[15..0] = port A[15..0]
bus BA[2..0] = port BA[2..0]
bus DM[7..0] = port DM[7..0]
bus DQ[63..0] = port DQ[63..0]

### Notes on the sheet
- (near J) NOTE THIS IS A DDR3L COMPLIANT PINOUT NON ECC

### Library data of the parts
J = 2013289-1: 204 Position 0.6 mm Pitch Right Angle Surface Mount Socket DIMM Connector; Number_of_Positions: 204; MF: TE Connectivity; Centerline_Pitch: .6 mm[.024 in]; Product_Type: Socket; Package: None; Digi-Key_Purchase_URL: https://www.digikey.com/product-detail/en/te-connectivity-amp-connectors/2013289-1/A115021-ND/2135546?utm_source=snapeda&utm_medium=aggregator&utm_campaign=symbol; Digi-Key_Part_Number: A115021-ND; SnapEDA_Link: https://www.snapeda.com/parts/2013289-1/TE%20Connectivity%20AMP%20Connectors/view-part/231016/?ref=snap; MP: 2013289-1; TE_purchase_URL: https://www.te.com/usa-en/product-2013289-1.html?te_bu=Cor&te_type=disp&te_campaign=seda_glo_cor-seda-global-disp-prtnr-fy19-seda-model-bom-cta_sma-317_1&elqCampaignId=32493; Value: *

## Nets that join several sheets
CFGBVS: FPGA Board Top (6 pins), A200T Top Level (62 pins), FPGA RAM (J.199)
DXN: FPGA Board Top (5 pins), A200T Top Level (137 pins), FPGA RAM (52 pins)
Vccadc: FPGA Board Top (TP9.1), A200T Top Level (15 pins)
Vccbram: FPGA Board Top (TP6.1), A200T Top Level (33 pins)
Vmgtavtt: FPGA Board Top (TP8.1), A200T Top Level (6 pins)
Vrefp: FPGA Board Top (TP7.1), A200T Top Level (U2.M10)
A0: A200T Top Level (U2.K22), FPGA RAM (J.98)
A1: A200T Top Level (U2.K21), FPGA RAM (J.97)
A2: A200T Top Level (U2.G20), FPGA RAM (J.96)
A3: A200T Top Level (U2.H20), FPGA RAM (J.95)
A4: A200T Top Level (U2.H22), FPGA RAM (J.92)
A5: A200T Top Level (U2.J22), FPGA RAM (J.91)
A6: A200T Top Level (U2.H18), FPGA RAM (J.90)
A7: A200T Top Level (U2.H17), FPGA RAM (J.86)
A8: A200T Top Level (U2.H15), FPGA RAM (J.89)
A9: A200T Top Level (U2.J15), FPGA RAM (J.85)
A10: A200T Top Level (U2.G18), FPGA RAM (J.107)
A11: A200T Top Level (U2.G17), FPGA RAM (J.84)
A12: A200T Top Level (U2.G16), FPGA RAM (J.83)
A13: A200T Top Level (U2.G15), FPGA RAM (J.119)
A14: A200T Top Level (U2.G13), FPGA RAM (J.80)
A15: A200T Top Level (U2.H13), FPGA RAM (J.78)
BA0: A200T Top Level (U2.J20), FPGA RAM (J.109)
BA1: A200T Top Level (U2.L21), FPGA RAM (J.108)
BA2: A200T Top Level (U2.M21), FPGA RAM (J.79)
CAS: A200T Top Level (U2.J19), FPGA RAM (J.115)
CK0_N: A200T Top Level (U2.H14), FPGA RAM (J.103)
CK0_P: A200T Top Level (U2.J14), FPGA RAM (J.101)
CKE0: A200T Top Level (U2.M22), FPGA RAM (J.73)
CLK0: FPGA Board Top (Q1.3), A200T Top Level (U2.T5)
CS0: A200T Top Level (U2.N22), FPGA RAM (J.114)
DONE: FPGA Board Top (TP4.1), A200T Top Level (U2.G11)
DQ0: A200T Top Level (U2.F13), FPGA RAM (J.5)
DQ1: A200T Top Level (U2.F14), FPGA RAM (J.7)
DQ2: A200T Top Level (U2.F16), FPGA RAM (J.15)
DQ3: A200T Top Level (U2.E17), FPGA RAM (J.17)
DQ4: A200T Top Level (U2.E13), FPGA RAM (J.4)
DQ5: A200T Top Level (U2.E14), FPGA RAM (J.6)
DQ6: A200T Top Level (U2.E16), FPGA RAM (J.16)
DQ7: A200T Top Level (U2.D16), FPGA RAM (J.18)
DQ8: A200T Top Level (U2.B15), FPGA RAM (J.21)
DQ9: A200T Top Level (U2.B16), FPGA RAM (J.23)
DQ10: A200T Top Level (U2.C13), FPGA RAM (J.33)
DQ11: A200T Top Level (U2.B13), FPGA RAM (J.35)
DQ12: A200T Top Level (U2.A13), FPGA RAM (J.22)
DQ13: A200T Top Level (U2.A14), FPGA RAM (J.24)
DQ14: A200T Top Level (U2.B17), FPGA RAM (J.34)
DQ15: A200T Top Level (U2.B18), FPGA RAM (J.36)
DQ16: A200T Top Level (U2.E19), FPGA RAM (J.39)
DQ17: A200T Top Level (U2.D19), FPGA RAM (J.41)
DQ18: A200T Top Level (U2.B20), FPGA RAM (J.51)
DQ19: A200T Top Level (U2.A20), FPGA RAM (J.53)
DQ20: A200T Top Level (U2.A18), FPGA RAM (J.40)
DQ21: A200T Top Level (U2.A19), FPGA RAM (J.42)
DQ22: A200T Top Level (U2.F19), FPGA RAM (J.50)
DQ23: A200T Top Level (U2.F20), FPGA RAM (J.52)
DQ24: A200T Top Level (U2.D20), FPGA RAM (J.57)
DQ25: A200T Top Level (U2.C20), FPGA RAM (J.59)
DQ26: A200T Top Level (U2.C22), FPGA RAM (J.67)
DQ27: A200T Top Level (U2.B22), FPGA RAM (J.69)
DQ28: A200T Top Level (U2.E22), FPGA RAM (J.56)
DQ29: A200T Top Level (U2.D22), FPGA RAM (J.58)
DQ30: A200T Top Level (U2.E21), FPGA RAM (J.68)
DQ31: A200T Top Level (U2.D21), FPGA RAM (J.70)
DQ32: A200T Top Level (U2.K13), FPGA RAM (J.129)
DQ33: A200T Top Level (U2.K14), FPGA RAM (J.131)
DQ34: A200T Top Level (U2.M13), FPGA RAM (J.141)
DQ35: A200T Top Level (U2.L13), FPGA RAM (J.143)
DQ36: A200T Top Level (U2.L14), FPGA RAM (J.130)
DQ37: A200T Top Level (U2.L15), FPGA RAM (J.132)
DQ38: A200T Top Level (U2.L16), FPGA RAM (J.140)
DQ39: A200T Top Level (U2.K16), FPGA RAM (J.142)
DQ40: A200T Top Level (U2.W21), FPGA RAM (J.147)
DQ41: A200T Top Level (U2.W22), FPGA RAM (J.149)
DQ42: A200T Top Level (U2.AA20), FPGA RAM (J.157)
DQ43: A200T Top Level (U2.AA21), FPGA RAM (J.159)
DQ44: A200T Top Level (U2.AB21), FPGA RAM (J.146)
DQ45: A200T Top Level (U2.AB22), FPGA RAM (J.148)
DQ46: A200T Top Level (U2.U20), FPGA RAM (J.158)
DQ47: A200T Top Level (U2.V20), FPGA RAM (J.160)
DQ48: A200T Top Level (U2.V18), FPGA RAM (J.163)
DQ49: A200T Top Level (U2.V19), FPGA RAM (J.165)
DQ50: A200T Top Level (U2.V17), FPGA RAM (J.175)
DQ51: A200T Top Level (U2.W17), FPGA RAM (J.177)
DQ52: A200T Top Level (U2.AA18), FPGA RAM (J.164)
DQ53: A200T Top Level (U2.AB18), FPGA RAM (J.166)
DQ54: A200T Top Level (U2.U17), FPGA RAM (J.174)
DQ55: A200T Top Level (U2.U18), FPGA RAM (J.176)
DQ56: A200T Top Level (U2.P14), FPGA RAM (J.181)
DQ57: A200T Top Level (U2.R14), FPGA RAM (J.183)
DQ58: A200T Top Level (U2.R18), FPGA RAM (J.191)
DQ59: A200T Top Level (U2.T18), FPGA RAM (J.193)
DQ60: A200T Top Level (U2.P15), FPGA RAM (J.180)
DQ61: A200T Top Level (U2.R16), FPGA RAM (J.182)
DQ62: A200T Top Level (U2.N13), FPGA RAM (J.192)
DQ63: A200T Top Level (U2.N14), FPGA RAM (J.194)
DQS0_N: A200T Top Level (U2.C15), FPGA RAM (J.10)
DQS0_P: A200T Top Level (U2.C14), FPGA RAM (J.12)
DQS1_N: A200T Top Level (U2.A16), FPGA RAM (J.27)
DQS1_P: A200T Top Level (U2.A15), FPGA RAM (J.29)
DQS2_N: A200T Top Level (U2.E18), FPGA RAM (J.45)
DQS2_P: A200T Top Level (U2.F18), FPGA RAM (J.47)
DQS3_N: A200T Top Level (U2.A21), FPGA RAM (J.62)
DQS3_P: A200T Top Level (U2.B21), FPGA RAM (J.64)
DQS4_N: A200T Top Level (U2.J17), FPGA RAM (J.135)
DQS4_P: A200T Top Level (U2.K17), FPGA RAM (J.137)
DQS5_N: A200T Top Level (U2.Y22), FPGA RAM (J.152)
DQS5_P: A200T Top Level (U2.Y21), FPGA RAM (J.154)
DQS6_N: A200T Top Level (U2.AB20), FPGA RAM (J.169)
DQS6_P: A200T Top Level (U2.AA19), FPGA RAM (J.171)
DQS7_N: A200T Top Level (U2.P17), FPGA RAM (J.186)
DQS7_P: A200T Top Level (U2.N17), FPGA RAM (J.188)
INIT: FPGA Board Top (TP2.1), A200T Top Level (U2.U12)
M0: FPGA Board Top (P3.2), A200T Top Level (U2.U11)
M1: FPGA Board Top (P2.2), A200T Top Level (U2.U10)
M2: FPGA Board Top (P1.2), A200T Top Level (U2.U9)
ODT0: A200T Top Level (U2.M18), FPGA RAM (J.116)
PROGRAM: FPGA Board Top (TP3.1), A200T Top Level (U2.N12)
RAS: A200T Top Level (U2.J21), FPGA RAM (J.110)
RESET: A200T Top Level (U2.D14), FPGA RAM (J.30)
SA0: FPGA Board Top (P5.4), FPGA RAM (J.197)
SA1: FPGA Board Top (P5.2), FPGA RAM (J.201)
SCL: FPGA Board Top (P5.3), FPGA RAM (J.202)
SDA: FPGA Board Top (P5.1), FPGA RAM (J.200)
TCK: FPGA Board Top (P4.2), A200T Top Level (U2.V12)
TDI: FPGA Board Top (P4.3), A200T Top Level (U2.R13)
TDO: FPGA Board Top (P4.1), A200T Top Level (U2.U13)
TMS: FPGA Board Top (P4.4), A200T Top Level (U2.T13)
WE: A200T Top Level (U2.H19), FPGA RAM (J.113)